# EAGLE schematic nedo1800s (EAGLE 5.01)
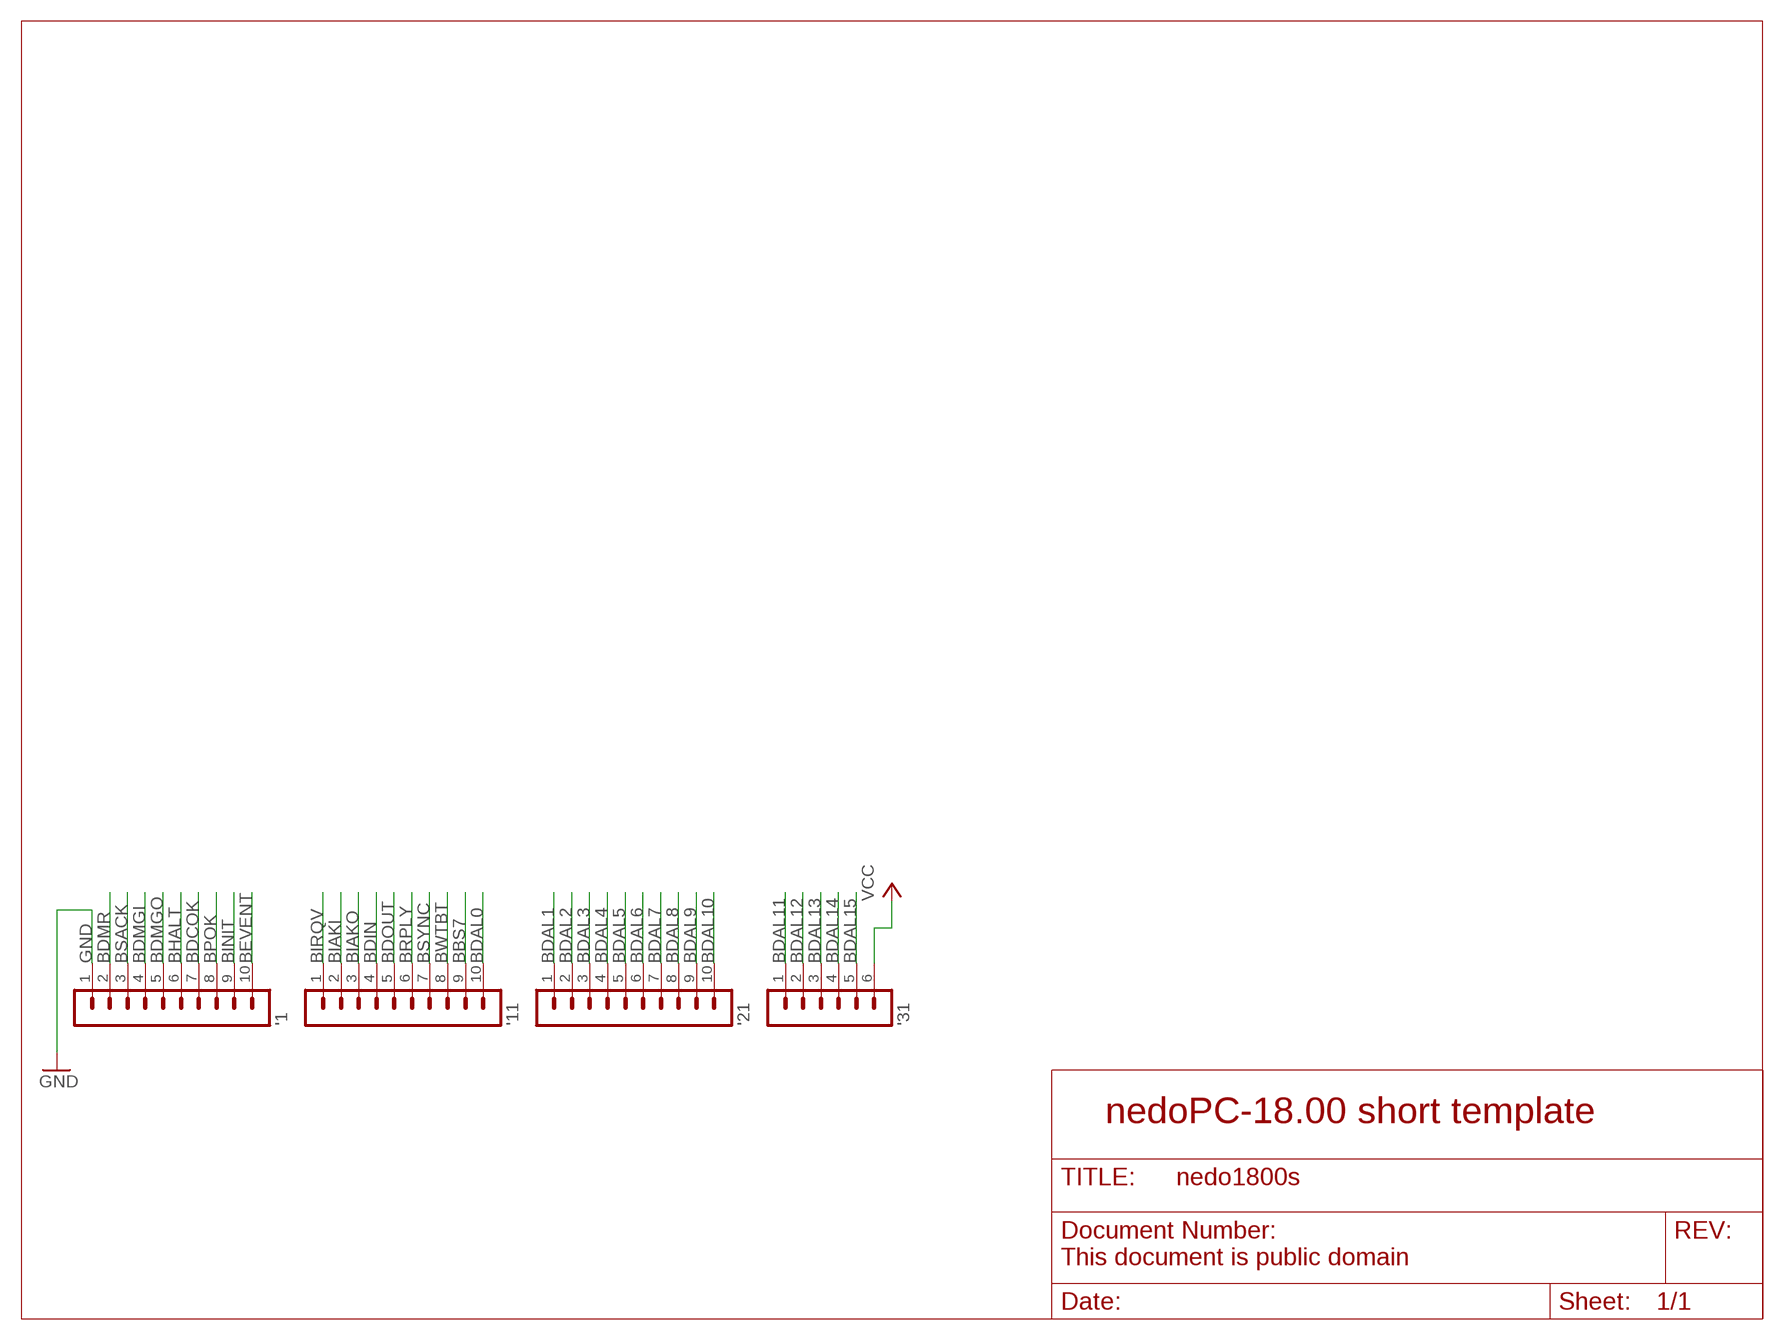
[diagram p0: schematic, sheet 1]

## Parts
'1  MA10-1  [MA10-1]
'11  MA10-1  [MA10-1]
'21  MA10-1  [MA10-1]
'31  MA06-1  [MA06-1]

## Nets
BBS7: '11.9
BDAL0: '11.10
BDAL1: '21.1
BDAL2: '21.2
BDAL3: '21.3
BDAL4: '21.4
BDAL5: '21.5
BDAL6: '21.6
BDAL7: '21.7
BDAL8: '21.8
BDAL9: '21.9
BDAL10: '21.10
BDAL11: '31.1
BDAL12: '31.2
BDAL13: '31.3
BDAL14: '31.4
BDAL15: '31.5
BDCOK: '1.7
BDIN: '11.4
BDMGI: '1.4
BDMGO: '1.5
BDMR: '1.2
BDOUT: '11.5
BEVENT: '1.10
BHALT: '1.6
BIAKI: '11.2
BIAKO: '11.3
BINIT: '1.9
BIRQV: '11.1
BPOK: '1.8
BRPLY: '11.6
BSACK: '1.3
BSYNC: '11.7
BWTBT: '11.8
GND: '1.1
VCC: '31.6

## Notes on the sheet
- nedoPC-18.00 short template
- This document is public domain

## Library data of the parts
'1 '11 '21 = con-lstb:MA10-1: PIN HEADER
'31 = con-lstb:MA06-1: PIN HEADER